# EAGLE schematic Reaccion_UserInterface (EAGLE 6.4)
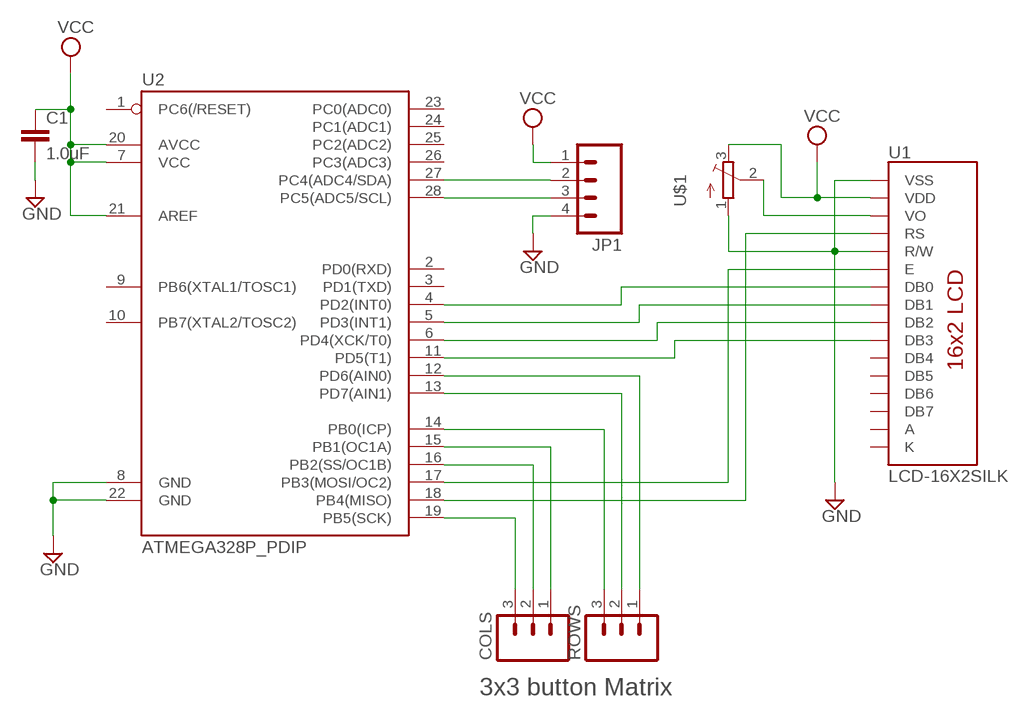
[diagram p0: schematic, sheet 1]

## Parts
C1  1.0uF  1.0UF-25V-+80/-20(0805)  [0805]
COLS  M03  [JST-3-SMD]
JP1  M04PTH  [1X04]
ROWS  M03  [JST-3-SMD]
U1  LCD-16X2SILK  [LCD-16X2]
U2  ATMEGA328P_PDIP  [DIL28-3]
U$1  TRIMPOTTC33X  [TC33X]

## Nets
GND: C1.2 JP1.4 U1.1(VSS) U1.5(R/W) U2.8(GND) U2.22(GND) U$1.1(A)
N$1: JP1.2 U2.27(PC4(ADC4/SDA))
N$2: JP1.3 U2.28(PC5(ADC5/SCL))
N$3: U1.7(DB0) U2.4(PD2(INT0))
N$4: U1.8(DB1) U2.5(PD3(INT1))
N$5: U1.9(DB2) U2.6(PD4(XCK/T0))
N$6: U1.10(DB3) U2.11(PD5(T1))
N$7: U1.6(E) U2.17(PB3(MOSI/OC2))
N$8: U1.4(RS) U2.18(PB4(MISO))
N$9: COLS.3 U2.19(PB5(SCK))
N$10: U1.3(VO) U$1.2(S)
N$11: COLS.2 U2.16(PB2(SS/OC1B))
N$12: COLS.1 U2.15(PB1(OC1A))
N$13: ROWS.3 U2.14(PB0(ICP))
N$14: ROWS.2 U2.13(PD7(AIN1))
N$15: ROWS.1 U2.12(PD6(AIN0))
VCC: C1.1 JP1.1 U1.2(VDD) U2.7(VCC) U2.20(AVCC) U2.21(AREF) U$1.3(E)
Unconnected: U1.11(DB4) U1.12(DB5) U1.13(DB6) U1.14(DB7) U2.1(PC6(/RESET)) U2.2(PD0(RXD)) U2.3(PD1(TXD)) U2.9(PB6(XTAL1/TOSC1)) U2.10(PB7(XTAL2/TOSC2)) U2.23(PC0(ADC0)) U2.24(PC1(ADC1)) U2.25(PC2(ADC2)) U2.26(PC3(ADC3))

## Notes on the sheet
- 3x3 button Matrix

## Power pins joined to a net without a drawn wire
A: U1.15(A)
K: U1.16(K)

## Library data of the parts
C1 = SparkFun-Capacitors:1.0UF-25V-+80/-20(0805); PROD_ID: CAP-11625
COLS ROWS = SparkFun-Connectors:M03: Header 3 Standard 3-pin 0.1" header. Use with straight break away headers (SKU : PRT-00116), right angle break away headers (PRT-00553), swiss pins (PRT-00743), machine pins (PRT-00117), and female headers (PRT-00115). Molex polarized connector foot print use with SKU : PRT-08232 with associated crimp pins and housings.
JP1 = SparkFun-Connectors:M04: Header 4 Standard 4-pin 0.1" header. Use with straight break away headers (SKU : PRT-00116), right angle break away headers (PRT-00553), swiss pins (PRT-00743), machine pins (PRT-00117), and female headers (PRT-00115). Molex polarized connector foot print use with SKU : PRT-08231 with associated crimp pins and housings. 1MM SMD Version SKU: PRT-10208
U1 = SparkFun-Displays:LCD-16X2: Standard text-only 16x2 parallel input LCD
U2 = SparkFun-DigitalIC:ATMEGA328P_PDIP: uC used in the Arduino 32kb flash, 1k EEPROM, 2k SRAM This is the through-hole version of this chip.
U$1 = adafruit:TRIMPOT: SMT trimmer potentiometer part number TC33X http://www.ladyada.net/library/eagle